# EAGLE design main (EAGLE 7.7.0)

## Sheet 1 of 3
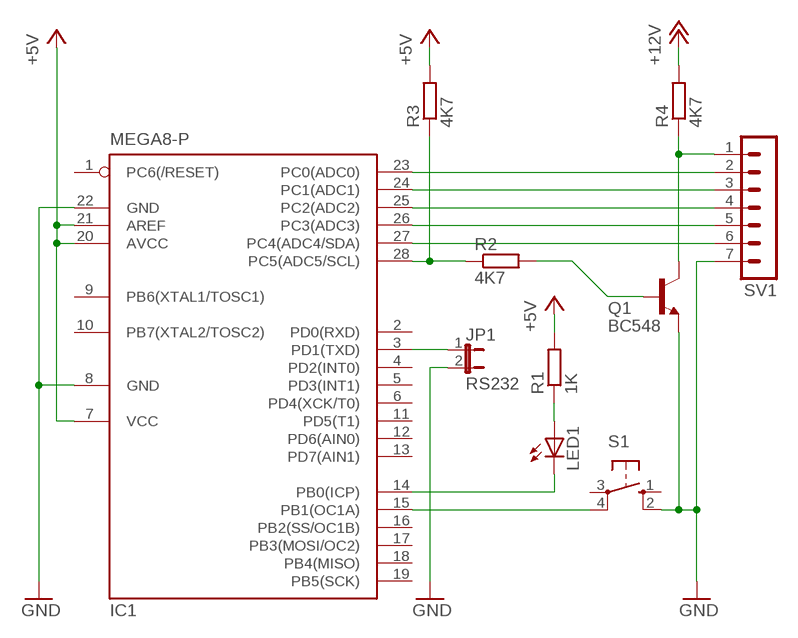
[diagram p0: schematic, sheet 1]

### Parts
IC1  MEGA8-P  [DIL28-3]
JP1  RS232  JP1E  [JP1]
LED1  LED5MM  [LED5MM]
Q1  BC548  [TO92-EBC]
R1  1K  R-EU_0204/7  [0204/7]
R2  4K7  R-EU_0204/7  [0204/7]
R3  4K7  R-EU_0204/7  [0204/7]
R4  4K7  R-EU_0204/7  [0204/7]
S1  40-XX  [B3F-40XX]
SV1  MA07-1  [MA07-1]

### Nets
+5V: IC1.7(VCC) IC1.20(AVCC) IC1.21(AREF) R1.2 R3.2 ; also sheet 3
+12V: R4.2 ; also sheet 2,3
GND: IC1.8(GND) IC1.22(GND) JP1.2 Q1.E S1.2(S1) SV1.7 ; also sheet 2,3
N$1: IC1.15(PB1(OC1A)) S1.4(P1)
N$2: IC1.14(PB0(ICP)) LED1.K(C)
N$3: LED1.A R1.1
N$4: IC1.27(PC4(ADC4/SDA)) SV1.6
N$5: Q1.B R2.2
N$6: Q1.C R4.1 SV1.1
N$7: IC1.28(PC5(ADC5/SCL)) R2.1 R3.1
N$8: IC1.26(PC3(ADC3)) SV1.5
N$9: IC1.25(PC2(ADC2)) SV1.4
N$10: IC1.24(PC1(ADC1)) SV1.3
N$11: IC1.23(PC0(ADC0)) SV1.2
N$13: IC1.3(PD1(TXD)) JP1.1
Unconnected: IC1.1(PC6(/RESET)) IC1.2(PD0(RXD)) IC1.4(PD2(INT0)) IC1.5(PD3(INT1)) IC1.6(PD4(XCK/T0)) IC1.9(PB6(XTAL1/TOSC1)) IC1.10(PB7(XTAL2/TOSC2)) IC1.11(PD5(T1)) IC1.12(PD6(AIN0)) IC1.13(PD7(AIN1)) IC1.16(PB2(SS/OC1B)) IC1.17(PB3(MOSI/OC2)) IC1.18(PB4(MISO)) IC1.19(PB5(SCK)) S1.1(S) S1.3(P)

## Sheet 2 of 3
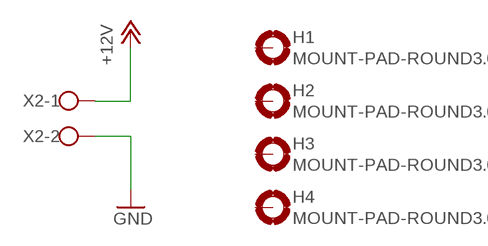
[diagram p1: schematic, sheet 2]

### Parts
H1  MOUNT-PAD-ROUND3.0  [3,0-PAD]
H2  MOUNT-PAD-ROUND3.0  [3,0-PAD]
H3  MOUNT-PAD-ROUND3.0  [3,0-PAD]
H4  MOUNT-PAD-ROUND3.0  [3,0-PAD]
X2  W237-102  [W237-102]

### Nets
+12V: X2.1 ; also sheet 1,3
GND: X2.2 ; also sheet 1,3
Unconnected: H1.B3,0(MOUNT) H2.B3,0(MOUNT) H3.B3,0(MOUNT) H4.B3,0(MOUNT)

## Sheet 3 of 3
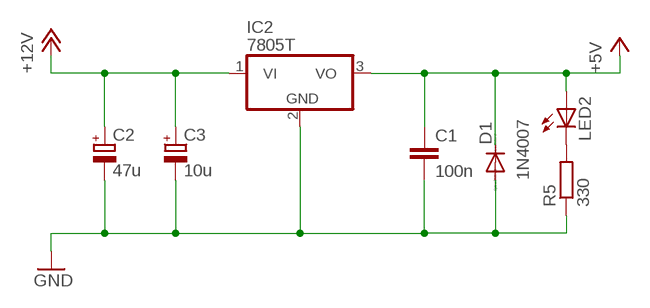
[diagram p2: schematic, sheet 3]

### Parts
C1  100n  C-EU025-025X050  [C025-025X050]
C2  47u  CPOL-EUE2.5-6  [E2,5-6]
C3  10u  CPOL-EUE2.5-6  [E2,5-6]
D1  1N4007  DIODE-D-7.5  [D-7.5]
IC2  7805T  [TO220H]
LED2  LED5MM  [LED5MM]
R5  330  R-EU_0204/7  [0204/7]

### Nets
+5V: C1.1 D1.C IC2.3(VO) LED2.A ; also sheet 1
+12V: C2.+ C3.+ IC2.1(VI) ; also sheet 1,2
GND: C1.2 C2.- C3.- D1.A IC2.2(GND) R5.1 ; also sheet 1,2
N$12: LED2.K(C) R5.2

## Library data of the parts
C1 = rcl:C-EU: CAPACITOR, European symbol
C2 C3 = rcl:CPOL-EU: POLARIZED CAPACITOR, European symbol
D1 = diode:DIODE-: DIODE
H1-H4 = holes:MOUNT-PAD-ROUND: MOUNTING PAD, round
IC1 = atmel:MEGA8-P: MICROCONTROLLER 8 Kbytes FLASH, 1 kbytes SRAM, 512 bytes EEPROM, USART, 4-channel 10 bit ADC, 2-channel 8 bit ADC Pin compatible with Atmega48, ATMega88, ATMega168 Source: avr.lbr; OC_FARNELL: unknown; OC_NEWARK: unknown
IC2 = linear:78*: Positive VOLTAGE REGULATOR Source: http://cache.national.com/ds/LM/LM78L05.pdf http://www.fairchildsemi.com/ds/LM/LM7805.pdf
JP1 = jumper:JP1E: JUMPER
LED1 LED2 = led:LED: LED OSRAM: - CHIPLED LG R971, LG N971, LY N971, LG Q971, LY Q971, LO R971, LY R971 LH N974, LH R974 LS Q976, LO Q976, LY Q976 LO Q996 - Hyper CHIPLED LW Q18S LB Q993, LB Q99A, LB R99A - SideLED LS A670, LO A670, LY A670, LG A670, LP A670 LB A673, LV A673, LT A673, LW A673 LH A674 LY A675 LS A676, LA A676, LO A676, LY A676, LW A676 LS A679, LY A679, LG A679 - Hyper Micro SIDELED® LS Y876, LA Y876, LO Y876, LY Y876 LT Y87S - SmartLED LW L88C, LW L88S LB L89C, LB L89S, LG L890 LS L89K, LO L89K, LY L89K LS L896, LA L896, LO L896, LY L896 - TOPLED LS T670, LO T670, LY T670, LG T670, LP T670 LSG T670, LSP T670, LSY T670, LOP T670, LYG T670 LG T671, LOG T671, LSG T671 LB T673, LV T673, LT T673, LW T673 LH T674 LS T676, LA T676, LO T676, LY T676, LB T676, LH T676, LSB T676, LW T676 LB T67C, LV T67C, LT T67C, LS T67K, LO T67K, LY T67K, LW E67C LS E67B, LA E67B, LO E67B, LY E67B, LB E67C, LV E67C, LT E67C LW T67C LS T679, LY T679, LG T679 LS T770, LO T770, LY T770, LG T770, LP T770 LB T773, LV T773, LT T773, LW T773 LH T774 LS E675, LA E675, LY E675, LS T675 LS T776, LA T776, LO T776, LY T776, LB T776 LHGB T686 LT T68C, LB T68C - Hyper Mini TOPLED® LB M676 - Mini TOPLED Santana® LG M470 LS M47K, LO M47K, LY M47K Source: http://www.osram.convergy.de LUXEON: - LUMILED® LXK2-PW12-R00, LXK2-PW12-S00, LXK2-PW14-U00, LXK2-PW14-V00 LXK2-PM12-R00, LXK2-PM12-S00, LXK2-PM14-U00 LXK2-PE12-Q00, LXK2-PE12-R00, LXK2-PE12-S00, LXK2-PE14-T00, LXK2-PE14-U00 LXK2-PB12-K00, LXK2-PB12-L00, LXK2-PB12-M00, LXK2-PB14-N00, LXK2-PB14-P00, LXK2-PB14-Q00 LXK2-PR12-L00, LXK2-PR12-M00, LXK2-PR14-Q00, LXK2-PR14-R00 LXK2-PD12-Q00, LXK2-PD12-R00, LXK2-PD12-S00 LXK2-PH12-R00, LXK2-PH12-S00 LXK2-PL12-P00, LXK2-PL12-Q00, LXK2-PL12-R00 Source: www.luxeon.com KINGBRIGHT: KA-3528ASYC Source: www.kingbright.com
Q1 = transistor-npn:BC548*: NPN Transistor
R1-R4 = rcl:R-EU_: RESISTOR, European symbol
R5 = resistor:R-EU_: RESISTOR, European symbol
S1 = switch-omron:40-XX: OMRON SWITCH; MF: OMRON COMPONENTS USA; MPN: B3F-4000; OC_FARNELL: 176434; OC_NEWARK: 36K3105
SV1 = con-lstb:MA07-1: PIN HEADER; OC_FARNELL: unknown; OC_NEWARK: unknown
X2 = con-wago-500:W237-102: WAGO SCREW CLAMP; MPN: 237-102; OC_FARNELL: unknown; OC_NEWARK: 70K9898

## Board
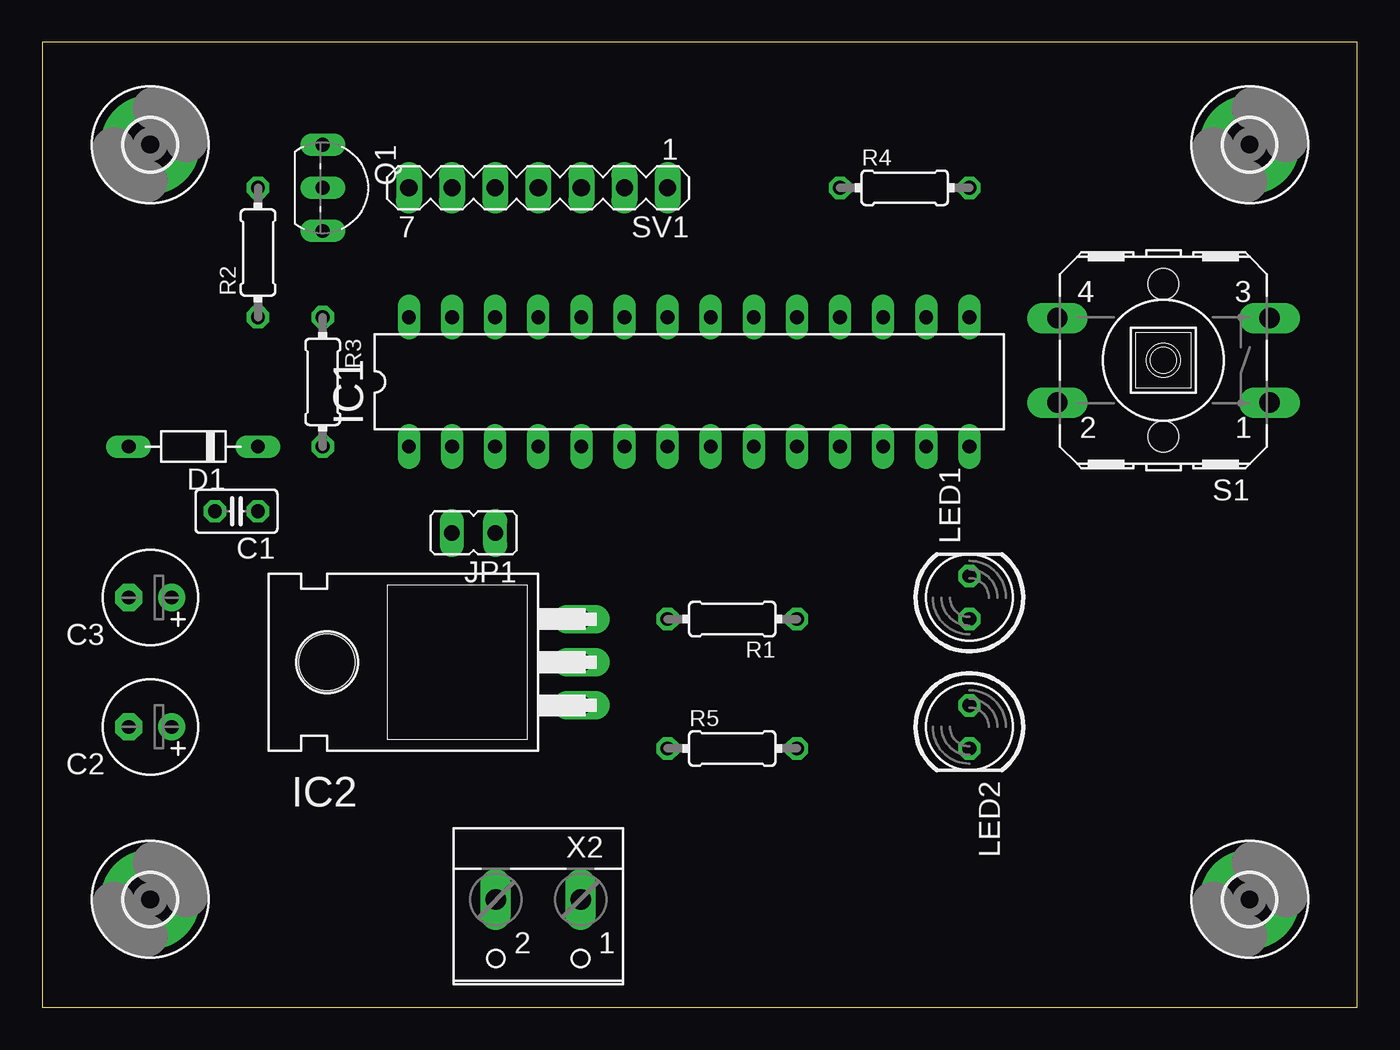
[diagram p3: board, top side]
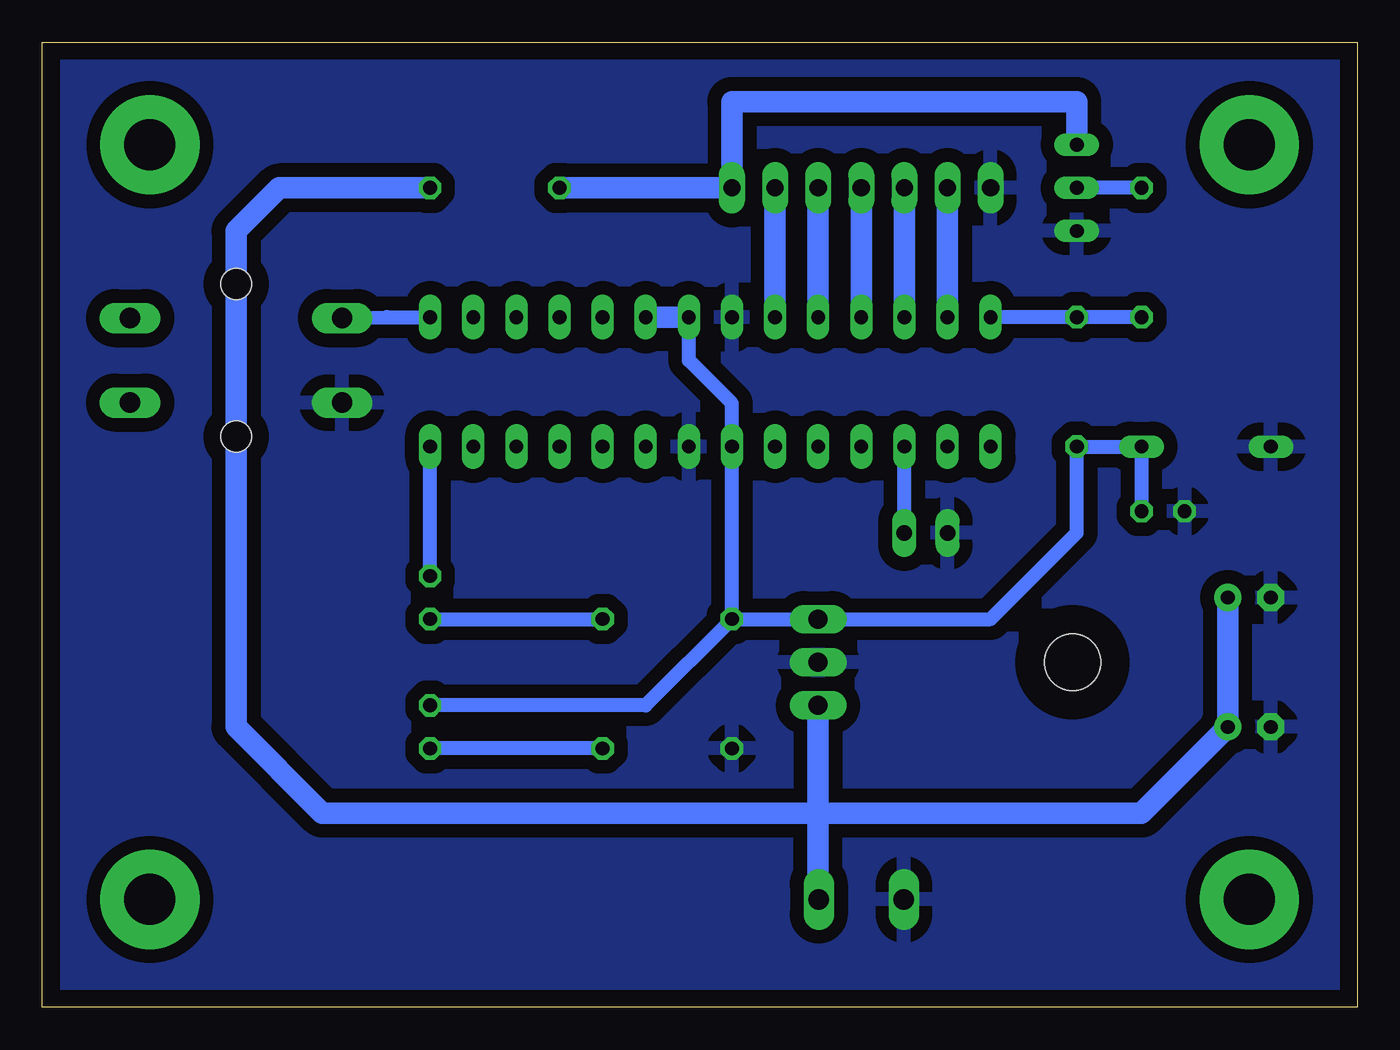
[diagram p4: board, bottom side, seen from below]

Size 77.45 x 56.82 mm. Coordinates in mm from the lower left corner, seen from the top.
Outline: 0,0 77.45,0 77.45,56.82 0,56.82 0,0
Copper layers (1*16): Top 0.035mm / dielectric 1.5mm / Bottom 0.035mm
Design rules "default *": minimum track width 10mil, minimum drill 24mil, track to track 8mil, track to pad 8mil, pad to pad 8mil, via to via 8mil, smd to smd 8mil, copper to edge 40mil, drill to drill 8mil, minimum pad ring 10mil, minimum via ring 8mil, stop-mask expansion 4mil, vias tented up to drill 0mil, thermal gap 30mil

### Footprints (pad centres in the part's own frame; a part is rotated, then mirrored left to right if it is on the bottom)
C025-025X050 = drill 0.813 octagon: 1 -1.27,0; 2 1.27,0
E2,5-6 = drill 0.813 pad 1.6: + -1.27,0 | drill 0.813 pad 1.6 octagon: - 1.27,0
D-7.5 = drill 0.813 long: A 3.81,0; C -3.81,0
3,0-PAD = drill 3 pad 5.842: B3,0 0,0
DIL28-3 = drill 0.813 long: 1 -16.51,-3.81; 2 -13.97,-3.81; 3 -11.43,-3.81; 4 -8.89,-3.81; 5 -6.35,-3.81; 6 -3.81,-3.81; 7 -1.27,-3.81; 8 1.27,-3.81; 9 3.81,-3.81; 10 6.35,-3.81; 11 8.89,-3.81; 12 11.43,-3.81; 13 13.97,-3.81; 14 16.51,-3.81; 15 16.51,3.81; 16 13.97,3.81; 17 11.43,3.81; 18 8.89,3.81; 19 6.35,3.81; 20 3.81,3.81; 21 1.27,3.81; 22 -1.27,3.81; 23 -3.81,3.81; 24 -6.35,3.81; 25 -8.89,3.81; 26 -11.43,3.81; 27 -13.97,3.81; 28 -16.51,3.81
TO220H = drill 1.118 long: 1 -2.54,-10.16; 2 0,-10.16; 3 2.54,-10.16 | hole 3.302: 0,4.826
JP1 = drill 0.914 long: 1 0,-1.27; 2 0,1.27
LED5MM = drill 0.813 octagon: A -1.27,0; K 1.27,0
TO92-EBC = drill 0.813 long: B 0,-1.27; C -2.54,-1.27; E 2.54,-1.27
0204/7 = drill 0.813 octagon: 1 -3.81,0; 2 3.81,0
B3F-40XX = drill 1.194 long: 1 -6.248,2.489; 2 6.248,2.489; 3 -6.248,-2.489; 4 6.248,-2.489 | hole 1.803: 0,-4.496; 0,4.496
MA07-1 = drill 1.016 long: 1 -7.62,0; 2 -5.08,0; 3 -2.54,0; 4 0,0; 5 2.54,0; 6 5.08,0; 7 7.62,0
W237-102 = drill 1.194 long: 1 -2.5,-1.27; 2 2.5,-1.27

### Placement (x,y rotation side)
C1  11.43,29.21 180 top
C2  6.35,16.51 180 top
C3  6.35,24.13 180 top
D1  8.89,33.02 180 top
H1  6.35,50.8 0 top
H2  6.35,6.35 0 top
H3  71.12,6.35 0 top
H4  71.12,50.8 0 top
IC1  38.1,36.83 0 top
IC2  21.59,20.32 90 top
JP1  25.4,27.94 90 top
LED1  54.61,24.13 90 top
LED2  54.61,16.51 270 top
Q1  17.78,48.26 270 top
R1  40.64,22.86 180 top
R2  12.7,44.45 90 top
R3  16.51,36.83 270 top
R4  50.8,48.26 0 top
R5  40.64,15.24 0 top
S1  66.04,38.1 180 top
SV1  29.21,48.26 180 top
X2  29.21,5.08 180 top

### Tracks (layer width: path | path; a pad name or v marks a point on that pad's centre or on a via)
+5V
  Bottom 0.813: R1.2 IC1.7 36.83,35.56 39.37,38.1 IC1.21 | R1.2 IC2.3 21.59,22.86 16.51,27.94 R3.2 D1.C C1.1 | R1.2 41.91,17.78 LED2.A
  Bottom 1.27: IC1.21 IC1.20
+12V
  Bottom 0.406: X2.1 31.75,6.35
  Bottom 1.27: R4.2 63.5,48.26 66.04,45.72 66.04,16.51 60.96,11.43 31.75,11.43 | IC2.1 31.75,11.43 | C3.+ C2.+ 12.7,11.43 31.75,11.43 | 31.75,6.35 31.75,11.43
GND
  pour Bottom (isolate 0.813): 1.27,55.88 76.2,55.88 76.2,1.27 1.27,1.27
N$1
  Bottom 0.406: S1.4 59.69,40.59
  Bottom 0.813: 59.69,40.59 57.15,40.64 IC1.15
N$2
  Bottom 0.813: LED1.K IC1.14
N$3
  Bottom 0.813: LED1.A R1.1
N$4
  Bottom 1.27: SV1.6 IC1.27
N$5
  Bottom 0.813: R2.2 Q1.B
N$6
  Bottom 1.27: R4.1 SV1.1 36.83,53.34 16.51,53.34 Q1.C
N$7
  Bottom 0.813: IC1.28 R3.1 R2.1
N$8
  Bottom 1.27: SV1.5 IC1.26
N$9
  Bottom 1.27: SV1.4 IC1.25
N$10
  Bottom 1.27: SV1.3 IC1.24
N$11
  Bottom 1.27: SV1.2 IC1.23
N$12
  Bottom 0.813: R5.2 LED2.K
N$13
  Bottom 0.813: JP1.1 IC1.3